# EAGLE design récepteur (EAGLE 9.6.2)
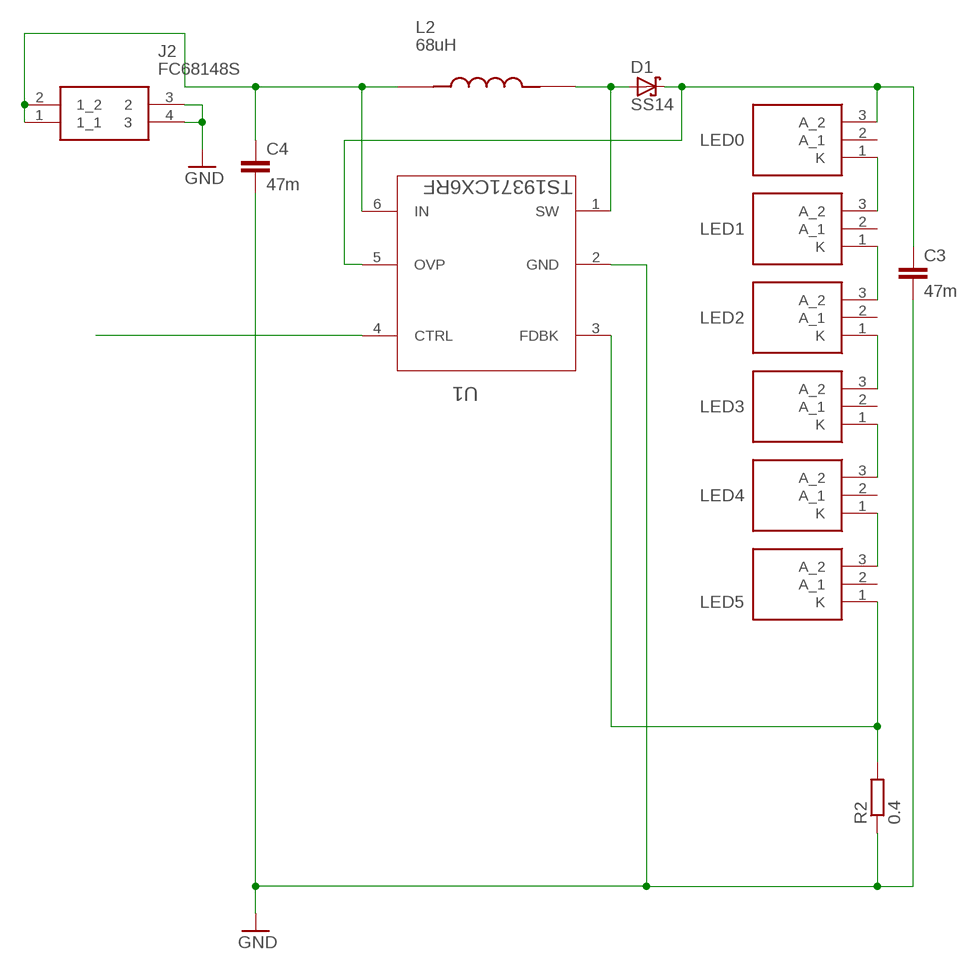
[diagram p0: schematic, sheet 1]

## Parts
C3  47m  C-EUC1206K  [C1206K]
C4  47m  C-EUC1206K  [C1206K]
D1  SS14  [DO-214AC]
J2  FC68148S  [FC68148S_2]
L2  68uH  1255AY-680M=P3  [IND_1255AY-680M=P3]
LED0  LED-CREE-JK3030  [JK3030AWT000000000A0HK230E]
LED1  LED-CREE-JK3030  [JK3030AWT000000000A0HK230E]
LED2  LED-CREE-JK3030  [JK3030AWT000000000A0HK230E]
LED3  LED-CREE-JK3030  [JK3030AWT000000000A0HK230E]
LED4  LED-CREE-JK3030  [JK3030AWT000000000A0HK230E]
LED5  LED-CREE-JK3030  [JK3030AWT000000000A0HK230E]
R2  0.4  R-EU_R1206  [R1206]
U1  TS19371CX6RF  [SOT95P280X125-6N]

## Nets
GND: C3.2 C4.2 J2.3 J2.4 R2.1 U1.2(GND)
N$1: LED0.1(K) LED1.3(A_2)
N$2: LED1.1(K) LED2.3(A_2)
N$4: LED2.1(K) LED3.3(A_2)
N$5: LED3.1(K) LED4.3(A_2)
N$6: LED4.1(K) LED5.3(A_2)
N$8: U1.4(CTRL)
N$9: LED5.1(K) R2.2 U1.3(FDBK)
N$10: C4.1 J2.1(1_1) J2.2(1_2) L2.1 U1.6(IN)
N$11: D1.A L2.2 U1.1(SW)
N$12: C3.1 D1.K LED0.3(A_2) U1.5(OVP)
Unconnected: LED0.2(A_1) LED1.2(A_1) LED2.2(A_1) LED3.2(A_1) LED4.2(A_1) LED5.2(A_1)

## Library data of the parts
C3 C4 = rcl:C-EU: CAPACITOR, European symbol; SPICEPREFIX: C
D1 = SS14 (1):SS14: Diodo de barrera Schottky (1N5819 SMD) (VRRM): 40V, IRMS: 1A Check prices <https://pricing.snapeda.com/parts/SS14/ON%20Semiconductor/view-part?ref=eda>; AVAILABILITY: In Stock; DESCRIPTION: Diode Schottky 40V 1A Surface Mount DO-214AC (SMA); MF: ON Semiconductor; MP: SS14; PACKAGE: SMA-2 ON Semiconductor; PRICE: None; PURCHASE-URL: https://pricing.snapeda.com/search/part/SS14/?ref=eda
J2 = FC68148S:FC68148S: CLIFF ELECTRONIC COMPONENTS - FC68148S - DC SOCKET, SMD, DC-10AS, 2.1MM PIN Source: Datasheet <http://www.cliffuk.co.uk/products/dcconnectors/FC68148S.pdf>; DESCRIPTION: CLIFF ELECTRONIC COMPONENTS - FC68148S - DC SOCKET, SMD, DC-10AS, 2.1MM PIN; HEIGHT: mm; MANUFACTURER_NAME: CLIFF ELECTRONIC COMPONENTS; MANUFACTURER_PART_NUMBER: FC68148S
L2 = 1255AY-680M_P3:1255AY-680M=P3: 3.9µH Shielded Wirewound Inductor 4.2A 26.4mOhm Max Nonstandard Check prices <https://pricing.snapeda.com/parts/1255AY-680M%3DP3/Murata/view-part?ref=eda>; AVAILABILITY: In Stock; DESCRIPTION: Inductor with Inductance: 68uH Tol. +/-20%, Package: 2424 (6060); MF: Murata; MP: 1255AY-680M=P3; PACKAGE: NONSTANDARD; PRICE: None; PURCHASE-URL: https://pricing.snapeda.com/search/part/1255AY-680M=P3/?ref=eda
LED0 LED1-LED5 = JK3030AWT-00-0000-000A0HK230E:LED-CREE-JK3030: High Power LEDs - White White, 121lm 3V, 80CRI Source: Datasheet <https://www.cree.com/led-components/media/documents/data-sheet-JSeries-3030.pdf>; ARROW_PART_NUMBER: JK3030AWT-00-0000-000A0HK230E; ARROW_PRICE-STOCK: https://www.arrow.com/en/products/jk3030awt-00-0000-000a0hk230e/cree; DESCRIPTION: High Power LEDs - White White, 121lm 3V, 80CRI; HEIGHT: 0.52mm; MANUFACTURER_NAME: Cree, Inc.; MANUFACTURER_PART_NUMBER: JK3030AWT-00-0000-000A0HK230E; MOUSER_PART_NUMBER: 941-JK3030W00A0HK230; MOUSER_PRICE-STOCK: https://www.mouser.co.uk/ProductDetail/Cree-Inc/JK3030AWT-00-0000-000A0HK230E?qs=chTDxNqvsykLVimImQcLAg%3D%3D
R2 = rcl:R-EU_: RESISTOR, European symbol; SPICEPREFIX: R
U1 = TS19371:TS19371CX6RF: Boost (Step-up) WLED Driver with OVP; MPN: TS19371CX6RF; OC_FARNELL: 1824780; OC_NEWARK: 79R6662; PACKAGE: SOT-26-6; SUPPLIER: Taiwan Semiconductors

## Board
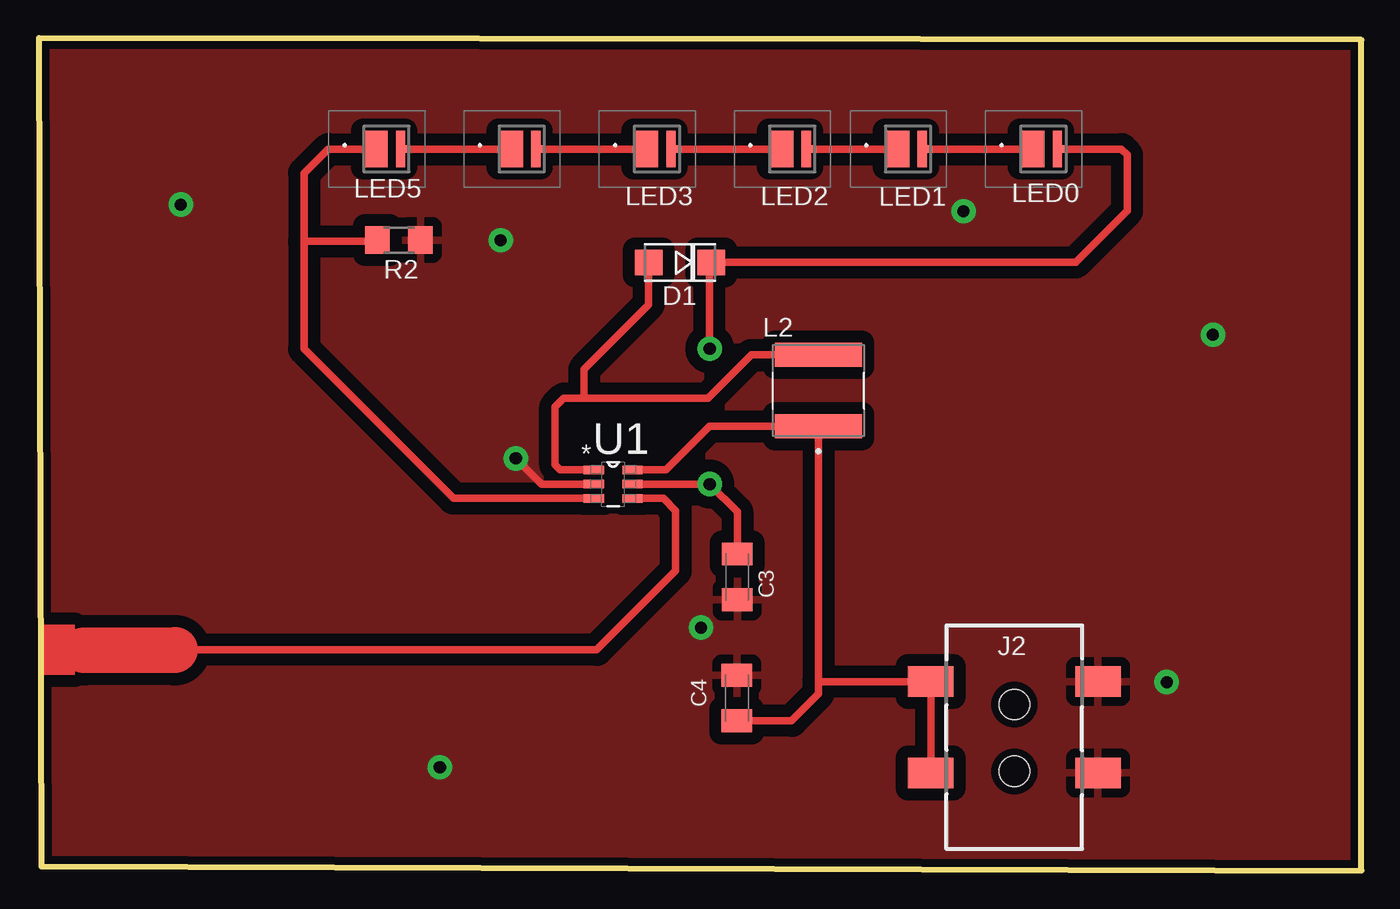
[diagram p1: board, top side]
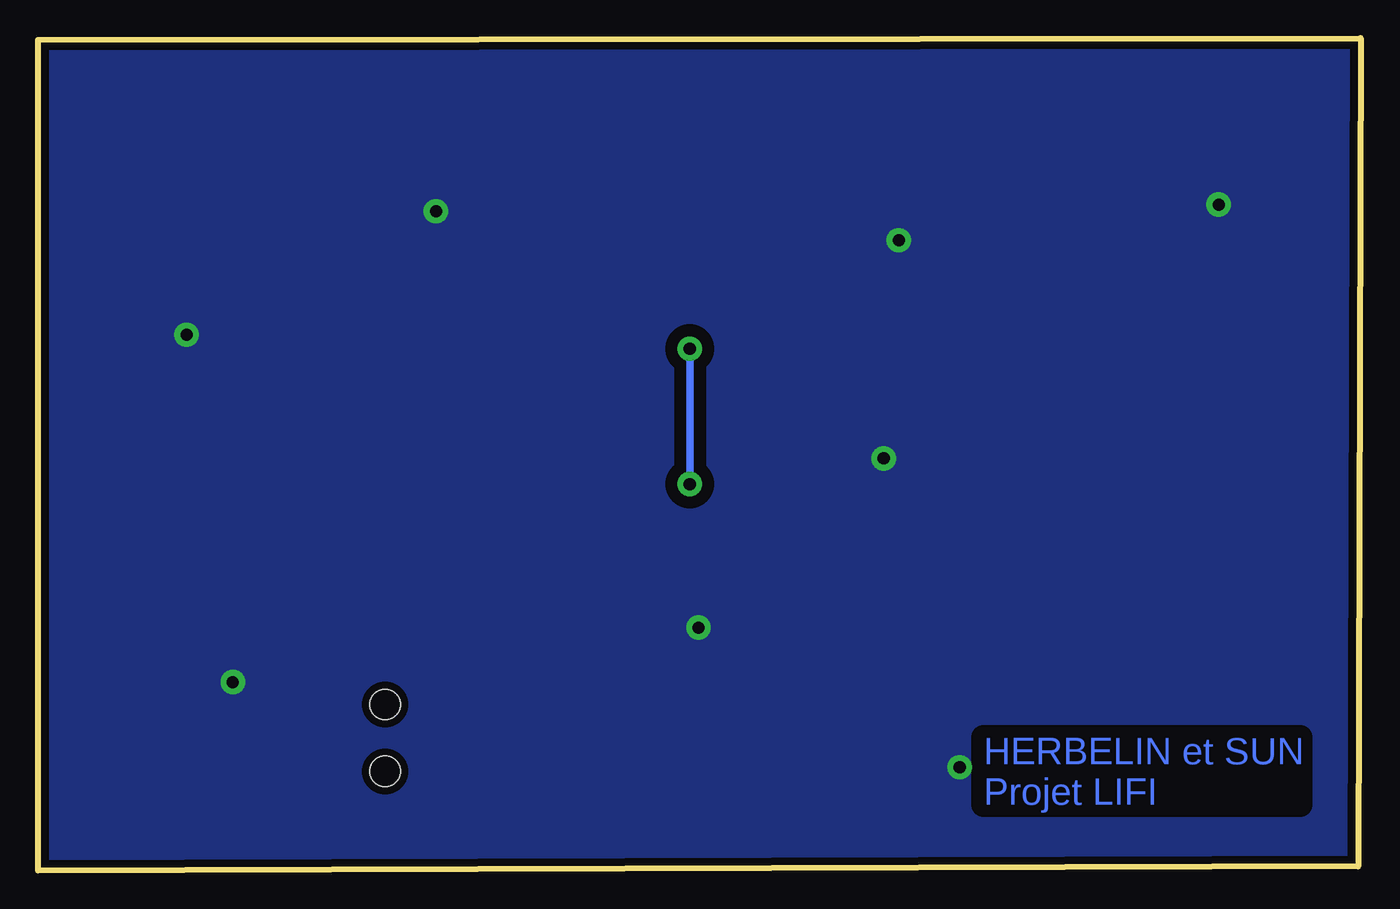
[diagram p2: board, bottom side, seen from below]

Size 86.96 x 54.71 mm. Coordinates in mm from the lower left corner, seen from the top.
Outline: 0.17,0.28 86.96,0 86.96,54.6 0,54.71 0.17,0.28
Copper layers (1*16): Top 0.035mm / dielectric 1.5mm / Bottom 0.035mm
Design rules "default *": minimum track width 0.5mm, minimum drill 0.8mm, track to track 0.8mm, track to pad 0.8mm, pad to pad 0.8mm, via to via 0.8mm, smd to smd 6mil, copper to edge 0.5mm, drill to drill 0.8mm, minimum pad ring 10mil, minimum via ring 8mil, stop-mask expansion 4mil, vias tented up to drill 0mil, thermal gap 0.6mm

### Footprints (pad centres in the part's own frame; a part is rotated, then mirrored left to right if it is on the bottom)
C1206K = smd 1.5 x 2: 1 -1.5,0; 2 1.5,0
DO-214AC = smd 1.8 x 1.7: A 2.05,0; K -2.05,0
FC68148S_2 = smd 3 x 2: 1 -5.5,-0.1; 2 -5.5,5.9; 3 5.5,5.9; 4 5.5,-0.1 | hole 2: 0,0; 0,4.4
IND_1255AY-680M=P3 = smd 1.6 x 5.7: 1 -2.35,0; 2 2.35,0
JK3030AWT000000000A0HK230E = smd 1.6 x 2.4: 1 -0.725,0 | smd 0.6 x 2.4: 2 0.925,0 | smd 0.3 x 0.5: 3 1.375,0
R1206 = smd 1.6 x 1.803: 1 -1.422,0; 2 1.422,0
SOT95P280X125-6N = smd 1.321 x 0.559: 1 -1.27,0.94; 2 -1.27,0; 3 -1.27,-0.94; 4 1.27,-0.94; 5 1.27,0; 6 1.27,0.94

### Placement (x,y rotation side)
C3  45.92,19.3 270 top
C4  45.9,11.34 90 top
D1  42.15,39.97 180 top
J2  64.14,6.52 0 top
L2  51.26,31.55 90 top
LED0  66.04,47.42 0 top
LED1  57.15,47.42 0 top
LED2  49.53,47.42 0 top
LED3  40.64,47.42 0 top
LED4  31.75,47.42 0 top
LED5  22.86,47.42 0 top
R2  23.67,41.43 180 top
U1  37.76,25.4 0 top

### Tracks (layer width: path | path; a pad name or v marks a point on that pad's centre or on a via)
GND  (via drill 0.8 pad 1.6)
  Top 0.5: U1.2 33.05,25.4 v31.36,27.09
  other vias: 43.54,15.96 30.37,41.43 74.16,12.38 9.33,43.76 26.37,6.79 77.19,35.22 60.79,43.33
  pour Top: 0.14,54.61 0.14,0.22 86.98,0.22 86.98,54.61
  pour Bottom: -0.01,54.61 -0.01,0.14 86.96,0.14 86.96,54.61
N$1
  Top 0.5: LED1.3 LED0.1
N$2
  Top 0.5: LED2.3 LED1.1
N$4
  Top 0.5: LED3.3 LED2.1
N$5
  Top 0.5: LED4.3 LED3.1
N$6
  Top 0.5: LED5.3 LED4.1
N$8
  Top 0.5: U1.4 41.06,24.46 41.87,23.65 41.87,19.7 36.68,14.5 8.98,14.5
  Top 3: 8.98,14.5 8.94,14.46 2.96,14.46
N$9
  Top 0.5: U1.3 27.27,24.46 17.44,34.29 17.44,41.35 | 17.44,41.35 17.44,45.83 19.02,47.42 LED5.1 | 17.44,41.35 22.16,41.35 | 22.16,41.35 22.17,41.35 | R2.2 22.16,41.5 22.16,41.35
N$10
  Top 0.5: U1.6 41.24,26.34 44.09,29.2 L2.1 51.26,12.42 | C4.1 49.49,9.84 51.26,11.61 51.26,12.42 | 51.26,12.42 51.26,12.41 J2.2 J2.1
N$11
  Top 0.5: 36.72,26.39 U1.1 34.28,26.34 33.95,26.67 33.95,30.48 34.5,31.03 35.85,31.03 | 35.85,31.03 43.99,31.03 46.85,33.9 L2.2 | D1.A 40.1,37.19 35.85,32.95 35.85,31.03
N$12  (via drill 0.8 pad 1.6)
  Top 0.5: 39,25.41 U1.5 v44.11,25.4 45.92,23.58 C3.1 | D1.K 44.16,39.93 | D1.K 68.17,39.97 71.56,43.36 71.56,47.04 71.18,47.42 LED0.3 | v44.11,34.29 44.11,39.87 D1.K
  Bottom 0.5: v44.11,34.29 v44.11,25.4
(copper drawn outside any net)
  shapes: Top area x1

### Text on the board
Bottom: HERBELIN et SUN / Projet LIFI